# Altium project morse_code_watch.PrjPcb
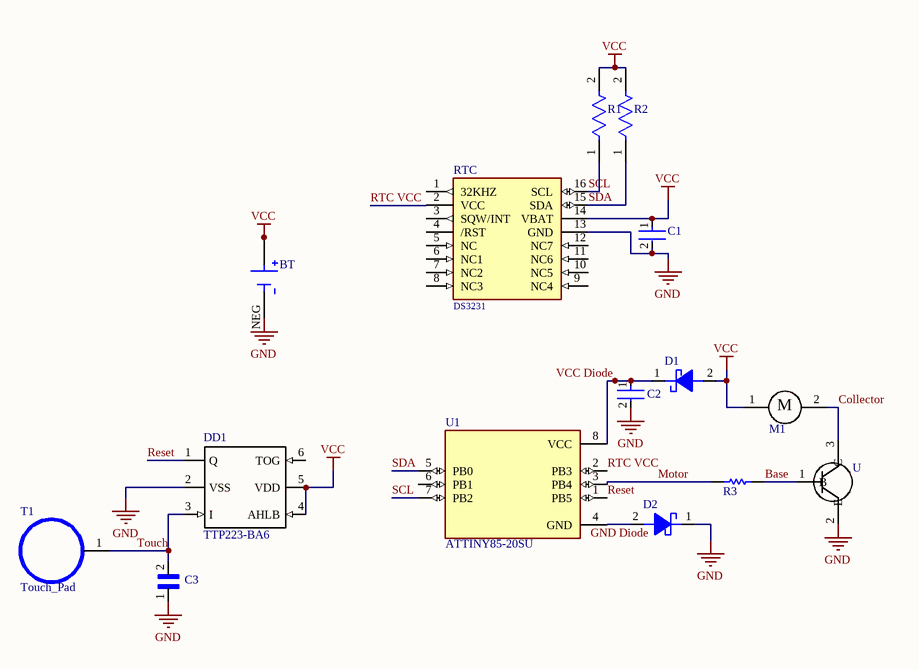
[diagram p0: morse_code_watch.SchDoc]
1 sheet, 15 parts. Net scope: global (net labels, ports and power ports of the same name join across sheets).
Board file: morse_code_watch.PcbDoc

## Sheet morse_code_watch.SchDoc: Morse Code Watch
size A; Author: Daniel Litt; DrawnBy: Daniel Litt; SheetNumber: 1; SheetTotal: 1

### Parts
BT  BC-2005  [BAT_BC-2005]  (value not drawn)
C1  C3216C0G1H104J160AA  [FP-C3216-160-0_2-IPC_B]  (value not drawn)
C2  C3216C0G1H104J160AA  [FP-C3216-160-0_2-IPC_B]  (value not drawn)
C3  08051A500GAT2A  [CAPC2012X94N]  (value not drawn)
D1  PMEG1020EA  [PMEG1020EA]  (value not drawn)
D2  PMEG1020EA  [PMEG1020EA]  (value not drawn)
DD1  TTP223-BA6  [SOT23-6]
M1  VZ4TL2B0620044P  [VZ4TL2B0620044P]  (value not drawn)
R1  RNCP0805FTD10K0  [FP-RNCP0805-IPC_C]  (value not drawn)
R2  RNCP0805FTD10K0  [FP-RNCP0805-IPC_C]  (value not drawn)
R3  ERA6AEB122V  [RESC2013X60X40LL20T25]  (value not drawn)
RTC  (no value)  [SO16W]
T1  Touch_Pad
U  BC847BT-7-F  [SOT50P160X90-3N]  (value not drawn)
U1  ATTINY85-20SU  [SOIC127P798X216-8N]

### Nets
GND: BT.NEG C1.2 C2.2 C3.1 D2.1 DD1.2(VSS) RTC.13(GND) U.2(E)
VCC: BT.S1+(POS) BT.S2+(POS) C1.1 D1.2 DD1.4(AHLB) DD1.5(VDD) M1.1 R1.2 R2.2 RTC.14(VBAT)
Base: R3.2 U.1(B)
Collector: M1.2 U.3(C)
GND Diode: D2.2 U1.4(GND)
Motor: R3.1 U1.3(PB4)
Reset: DD1.1(Q) U1.1(PB5)
RTC VCC: RTC.2(VCC) U1.2(PB3)
SCL: R1.1 RTC.16(SCL) U1.7(PB2)
SDA: R2.1 RTC.15(SDA) U1.5(PB0)
Touch: C3.2 DD1.3(I) T1.1
VCC Diode: C2.1 D1.1 U1.8(VCC)

Not connected (* = marked no-connect by the designer): DD1 6(TOG); RTC 1(32KHZ) 3(SQW/INT) 4(/RST) 5(NC) 6(NC1) 7(NC2) 8(NC3) 9(NC4) 10(NC5) 11(NC6) 12(NC7); U1 6(PB1)

### Notes on the sheet
- (in symbol VZ4TL2B0620044P) M

### Library data of the parts
BT = BC-2005: Battery Retainer Coin, 24.0mm 1 Cell SMD _SMT_ Tab; MF: MPD _Memory Protection Devices_; MP: BC-2005-TR; Value: *; Price: None; SnapEDA_Link: https://www.snapeda.com/parts/BC-2005-TR/MPD%20%28Memory%20Protection%20Devices%29/view-part/4449017/?ref=snap; Package: None; Availability: Unavailable
C1 C2 = CMP-08246-006180-1: Multilayer Ceramic Capacitors 100nF ±5% 50V C0G SMD 1206; Termination: SMD/SMT; Dielectric Material: Ceramic; Voltage Rating: 50V; Tolerance: 5%; Width: 1.6mm; Series: C; Voltage Rating (DC): 50V; RoHS Compliant: Yes; REACH SVHC: No SVHC; Package Quantity: 1; Case/Package: 1206; Height: 1.6mm; Thickness: 0.075inch; Weight: 0.000571oz; Length: 3.2mm; Number of Pins: 2; Max Operating Temperature: 125°C; Case Code (Imperial): 1206; Radiation Hardening: No; Packaging: Tape and Reel; Min Operating Temperature: -55°C; Case Code (Metric): 3216; Construction: Flat; Capacitance: 100nF; Mount: Surface Mount; Depth: 1.6mm; Lead Free: Lead Free; Dielectric: C0G
C3 = 08051A500GAT2A: Cap Ceramic 50pF 100V C0G 2% SMD 0805 125Â°C T/R; Package: None; Price: None; Value: *; MP: 08051A500GAT2A; Availability: Unavailable
DD1 = TTP223-BA6: 1 KEY TOUCH PAD DETECTOR IC
R1 R2 = CMP-26527-007436-1: 10kΩ ±1% 0.25W 0805 High Power Anti-Sulfur Thin Film Chip Resistor; Resistance: 10kR; Max Power Dissipation: 250mW; Temperature Coefficient: 100ppm/°C; Number of Terminations: 2; Length: 0.079inch; Case Code (Metric): 2012; Mount: Surface Mount; Resistor Type: Thin Film; Packaging: Tape and Reel; Tolerance: 1%; RoHS Compliant: Yes; Case Code (Imperial): 0805; Min Operating Temperature: -55°C; Max Operating Temperature: 155°C; Features: Moisture Resistant; Series: RNCP; Case/Package: 0805; Width: 0.049inch; Lead Free: Lead Free; Height: 0.024inch
R3 = CMP-2001-00589-1: Manufacturer: Panasonic; Part Number: ERA6AEB122V
RTC = DS3231: MF: Maxim Integrated; Value: *; MP: DS3231; Package: SOIC-16 Maxim Integrated; Price: None; SnapEDA_Link: https://www.snapeda.com/parts/DS3231/Maxim%20Integrated/view-part/553791/?ref=snap; Availability: Unavailable
U = BC847BT-7-F: Bipolar _BJT_ Transistor NPN 45V 100mA 100MHz 150mW Surface Mount SOT-523; MF: Diodes Inc.; SnapEDA_Link: https://www.snapeda.com/parts/BC847BT-7-F/Diodes%20Inc./view-part/316810/?ref=snap; Availability: Unavailable; Price: None; Package: SOT-523 Diodes Inc.; MP: BC847BT-7-F; Value: *
U1 = ATTINY85-20SU: AVR AVRÂ® ATtiny, IC de microcontrolador de seguridad funcional (FuSa) de 8 bits, 20 MHz, 8 KB (4K x 16), FLASH 8-SOIC; MF: Microchip; MP: ATTINY85-20SU; Package: SOIC-8 Microchip; SnapEDA_Link: https://www.snapeda.com/parts/ATTINY85-20SU/Microchip/view-part/681099/?ref=snap; Check_prices: https://www.snapeda.com/parts/ATTINY85-20SU/Microchip/view-part/681099/?ref=eda; Availability: In Stock; Value: *; Price: None